# Altium schematic sheet 05_SM32_MCU.SchDoc: STM32 F446 MCU
size B; DocumentNumber: 4; SheetNumber: 4; SheetTotal: 12
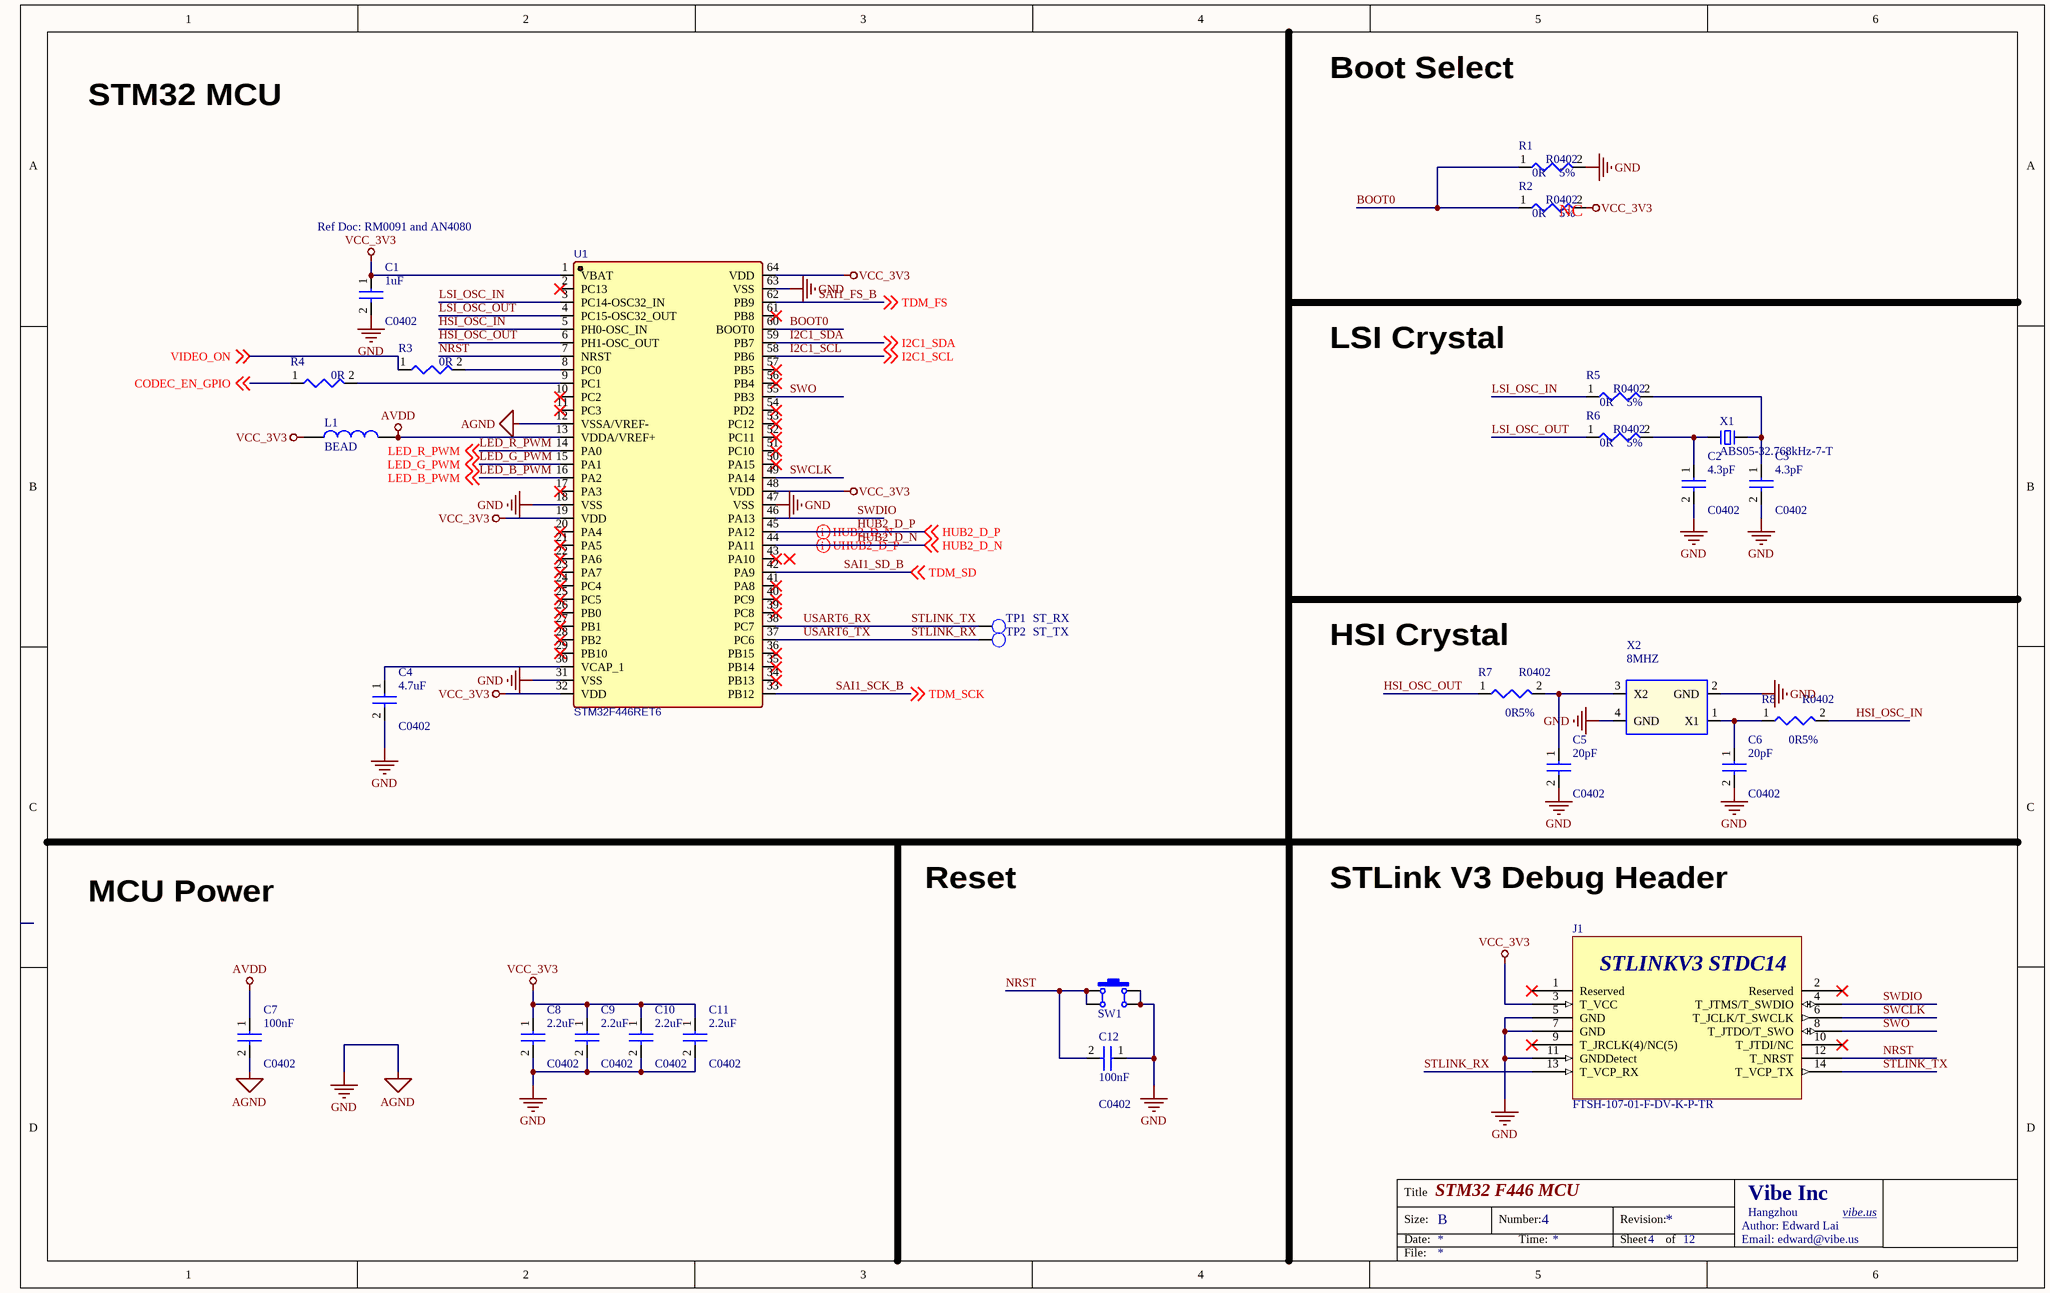
[diagram p0: 05_SM32_MCU.SchDoc]

## Parts
C1  1uF  PCB Footprint: C0402  [C0402_L]
C2  4.3pF  PCB Footprint: C0402  [C0402_L]
C3  4.3pF  PCB Footprint: C0402  [C0402_L]
C4  4.7uF  PCB Footprint: C0402  [C0402_L]
C5  20pF  PCB Footprint: C0402  [C0402_L]
C6  20pF  PCB Footprint: C0402  [C0402_L]
C7  100nF  PCB Footprint: C0402  [C0402_L]
C8  2.2uF  PCB Footprint: C0402  [C0402_L]
C9  2.2uF  PCB Footprint: C0402  [C0402_L]
C10  2.2uF  PCB Footprint: C0402  [C0402_L]
C11  2.2uF  PCB Footprint: C0402  [C0402_L]
C12  100nF  PCB Footprint: C0402  [C0402_L]
J1  FTSH-107-01-F-DV-K-P-TR  [SAMTEC-FTSH-107-01-X-DV]
L1  BEAD  [L0402]
R1  0R  Tolerance: 5%  [R0402]
R2  0R  Tolerance: 5%  [R0402]  (net tie, no BOM)
R3  0R  [R0402]
R4  0R  [R0402]
R5  0R  Tolerance: 5%  [R0402]
R6  0R  Tolerance: 5%  [R0402]
R7  0R  Tolerance: 5%  [R0402]
R8  0R  Tolerance: 5%  [R0402]
SW1  4x4x1.5  [TSW SMD-6*6*5]  (value not drawn)
TP1  ST_RX  [TP_0R70]  (no BOM)
TP2  ST_TX  [TP_0R70]  (no BOM)
U1  STM32F446RET6  [LQFP64_L]
X1  ABS05-32.768kHz-7-T  [XTAL_3215-32.768K]
X2  8MHZ  [XTAL_3225-8MHZ]

## Nets
AGND: C1.2 C2.2 C3.2 C4.2 C5.2 C6.2 C7.2 C8.2 C9.2 C10.2 C11.2 C12.1 J1.5(GND) J1.7(GND) J1.11(GNDDetect) R1.2 SW1.2 SW1.3 U1.12(VSSA/VREF-) U1.18(VSS) U1.31(VSS) U1.47(VSS) U1.63(VSS) X2.2(GND) X2.4(GND)  [also labelled GND]
AVDD: C7.1 L1.2 U1.13(VDDA/VREF+)
VCC_3V3: C1.1 C8.1 C9.1 C10.1 C11.1 J1.3(T_VCC) L1.1 R2.2 U1.1(VBAT) U1.19(VDD) U1.32(VDD) U1.48(VDD) U1.64(VDD)
BOOT0: R1.1 R2.1 U1.60(BOOT0)
CODEC_EN_GPIO: R4.1 ; off-sheet CODEC_EN_GPIO
HSI_OSC_IN: R8.2 U1.5(PH0-OSC_IN)
HSI_OSC_OUT: R7.1 U1.6(PH1-OSC_OUT)
HUB2_D_N: U1.44(PA11) ; off-sheet HUB2_D_N
HUB2_D_P: U1.45(PA12) ; off-sheet HUB2_D_P
I2C1_SCL: U1.58(PB6) ; off-sheet I2C1_SCL
I2C1_SDA: U1.59(PB7) ; off-sheet I2C1_SDA
LED_B_PWM: U1.16(PA2) ; off-sheet LED_B_PWM
LED_G_PWM: U1.15(PA1) ; off-sheet LED_G_PWM
LED_R_PWM: U1.14(PA0) ; off-sheet LED_R_PWM
LSI_OSC_IN: R5.1 U1.3(PC14-OSC32_IN)
LSI_OSC_OUT: R6.1 U1.4(PC15-OSC32_OUT)
NRST: C12.2 J1.12(T_NRST) SW1.1 SW1.4 U1.7(NRST)
SAI1_FS_B: U1.62(PB9) ; off-sheet TDM_FS  [also labelled TDM_FS]
SAI1_SCK_B: U1.33(PB12) ; off-sheet TDM_SCK  [also labelled TDM_SCK]
SAI1_SD_B: U1.42(PA9) ; off-sheet TDM_SD  [also labelled TDM_SD]
STLINK_RX: J1.13(T_VCP_RX) TP2.1 U1.37(PC6)  [also labelled USART6_TX]
STLINK_TX: J1.14(T_VCP_TX) TP1.1 U1.38(PC7)  [also labelled USART6_RX]
SWCLK: J1.6(T_JCLK/T_SWCLK) U1.49(PA14)
SWDIO: J1.4(T_JTMS/T_SWDIO) U1.46(PA13)
SWO: J1.8(T_JTDO/T_SWO) U1.55(PB3)
VIDEO_ON: R3.1 ; off-sheet VIDEO_ON
NetC2_1: C2.1 R6.2 X1.1
NetC3_1: C3.1 R5.2 X1.2
NetC4_1: C4.1 U1.30(VCAP_1)
NetC5_1: C5.1 R7.2 X2.3(X2)
NetC6_1: C6.1 R8.1 X2.1(X1)
NetR3_2: R3.2 U1.8(PC0)
NetR4_2: R4.2 U1.9(PC1)

Not connected (* = marked no-connect by the designer): J1 1(Reserved)* 2(Reserved)* 9(T_JRCLK(4)/NC(5))* 10(T_JTDI/NC)*; U1 2(PC13)* 10(PC2)* 11(PC3)* 17(PA3)* 20(PA4)* 21(PA5)* 22(PA6)* 23(PA7)* 24(PC4)* 25(PC5)* 26(PB0)* 27(PB1)* 28(PB2)* 29(PB10)* 34(PB13)* 35(PB14)* 36(PB15)* 39(PC8)* 40(PC9)* 41(PA8)* 43(PA10)* 50(PA15)* 51(PC10)* 52(PC11)* 53(PC12)* 54(PD2)* 56(PB4)* 57(PB5)* 61(PB8)*

## Layout directives
differential pair; differential pair class USB: HUB2_D_N, HUB2_D_P

## Notes on the sheet
- Boot Select
- STM32 MCU
- Ref Doc: RM0091 and AN4080
- (near R2) NC
- LSI Crystal
- (near R7) HSI Crystal
- MCU Power
- Reset
- STLink V3 Debug Header
- Title
- Size:
- Date:
- B
- Number:
- Time:
- Revision:
- Sheet
- of
- Author: Edward Lai
- Email: edward@vibe.us
- Vibe Inc
- Hangzhou
- vibe.us <http://vibe.us>
- File:
- (in symbol FTSH-107-01-F-DV-K-P-TR) STLINKV3 STDC14

## Library data of the parts
C1 = CAP NP_Dup1: cap,1.00uF,+/-10%,10V,X5R,C0402; Priority: A; Part Type: C0402
C2 C3 = CAP NP_Dup1: cap,4.3pF,+/-10%,25V,X5R,C0402; Priority: A; Part Type: C0402
C4 = CAP NP_Dup1: cap,4.70uF,+/-10%,6.3V,X5R,C0402; Priority: A; Part Type: C0402
C5 C6 = CAP NP_Dup1: cap,20pF,+/-10%,25V,X5R,C0402; Priority: A; Part Type: C0402
C7 C12 = CAP NP_Dup1: cap,100.00nF,+/-10%,10V,X5R,C0402; Priority: A; Part Type: C0402
C8-C11 = CAP NP_Dup1: cap,2.20uF,+/-10%,10V,X5R,C0402; Priority: A; Part Type: C0402
J1 = FTSH-107-01-F-DV-K-P-TR: Samtec 14Pin 2x7 Header Connector. / STM32_STLINK_V3 Debug
L1 = L-AL: 鐵氧體磁珠 33ohm 0.55A 550mOhms 0402 Chip Bead
R1 R2 R5-R8 = RESISTOR: 通用厚膜电阻,0R,+/-5%,R0402; Priority: A; PCB Footprint: R0402; Part Type: 通用厚膜电阻
R3 R4 = RESISTOR: 通用厚膜电阻,0R,+/-5%,R0402; Tolerance: 5%; Priority: A; PCB Footprint: R0402; Part Type: 通用厚膜电阻
SW1 = SW SMD-4x4: 贴片4x4轻触开关
TP1 TP2 = TP: Test Point 0.7mm; PCB Footprint: TP_0R50; Priority: A; Part Type: TP
X1 = XTAL-2P: ABS05-32.768kHz-7-T / 3215 2脚无源晶振(谐振器）
X2 = CRYSTAL_4P: 8MHZ (16pF), 3.2 mm x 2.5 mm / 无源晶振(谐振器）